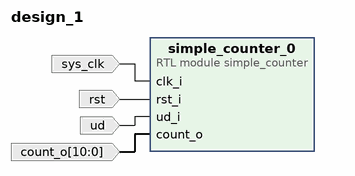
[diagram p0: block diagram of the top level]
# Vivado block design design_1, Vivado 2016.2
create_bd_design design_1

create_bd_port -dir I -type clk sys_clk
create_bd_port -dir I -type rst rst
set_property -dict {CONFIG.POLARITY ACTIVE_HIGH} [get_bd_ports rst]
create_bd_port -dir I -type data ud
create_bd_port -dir I -from 10 -to 0 count_o

create_bd_cell -type module -reference simple_counter simple_counter_0

# ---- connections ----

connect_bd_net [get_bd_ports sys_clk] [get_bd_pins simple_counter_0/clk_i]
connect_bd_net [get_bd_ports rst] [get_bd_pins simple_counter_0/rst_i]
connect_bd_net [get_bd_ports ud] [get_bd_pins simple_counter_0/ud_i]
connect_bd_net [get_bd_ports count_o] [get_bd_pins simple_counter_0/count_o]

validate_bd_design
save_bd_design
